# Altium schematic sheet USB.SchDoc
size A4
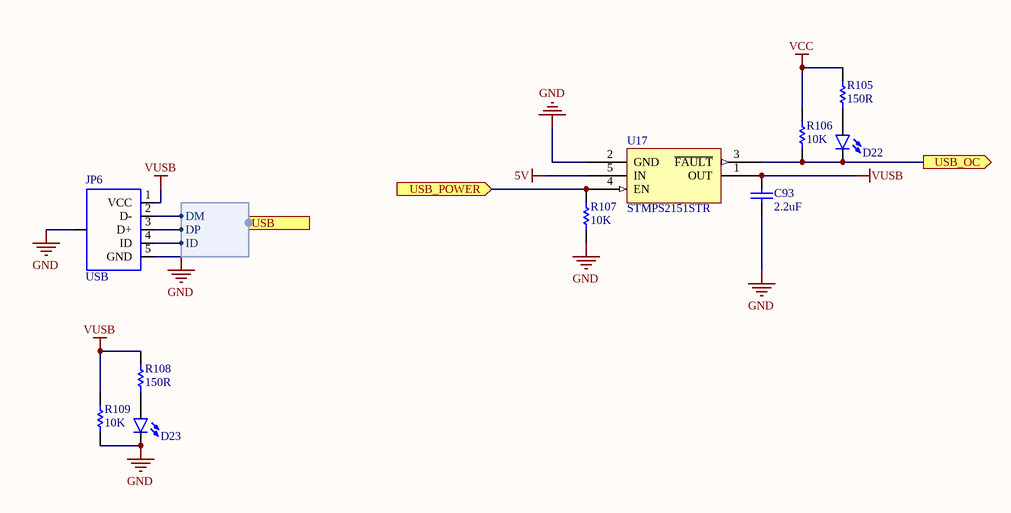
[diagram p0: USB.SchDoc]

## Parts
C93  value 2.2uF  [C1206[3216X160]]  (hidden comment: 2.2uF 16V 1206)
D22  USB_OC  [LED0603]  (value not drawn)
D23  USB_PW  [LED0603]  (value not drawn)
JP6  USB  [USB_MICROB_VERT]
R105  value 150R  [R0603[1608]]  (hidden comment: 150R 1% 0603)
R106  value 10K  [R0603[1608]]  (hidden comment: 10K 1% 0603)
R107  value 10K  [R0603[1608]]  (hidden comment: 10K 1% 0603)
R108  value 150R  [R0603[1608]]  (hidden comment: 150R 1% 0603)
R109  value 10K  [R0603[1608]]  (hidden comment: 10K 1% 0603)
U17  STMPS2151STR  [SOT-23-5L]

## Ports
USB (harness USB), USB_OC (out), USB_POWER (in)

## Harnesses
USB: DM, DP, ID

## Nets
5V: U17.5(IN)
GND: C93.2 D23.C JP6.5(GND) JP6.6(SHIELD) R107.1 R109.1 U17.2(GND)
VCC: R105.2 R106.2
VUSB: C93.1 JP6.1(VCC) R108.2 R109.2 U17.1(OUT)
USB_OC: D22.C R106.1 U17.3(~{FAULT}) ; port USB_OC
USB_POWER: R107.2 U17.4(EN) ; port USB_POWER
NetD22_A: D22.A R105.1
NetD23_A: D23.A R108.1
NetJP6_2: JP6.2(D-) ; port USB.DM
NetJP6_3: JP6.3(D+) ; port USB.DP
NetJP6_4: JP6.4(ID) ; port USB.ID

## Library data of the parts
C93 = CAP_2.2uF_16V_1206_10%: 2.2uF 16V 10% X7R 1206 (3216 Metric); PartNumber: C1206C225K4RACAUTO; Manufacturer: KEMET; Mounting Technology: Surface Mount; PackageReference: 1206; PackageDescription: 1206 (3216 Metric); Voltage: 16V; Tolerance: 10%
D22 D23 = LED_0603_GREEN_5mA: PartNumber: LTST-C193TGKT-5A; Manufacturer: Lite-On Inc.; PackageReference: 0603; PackageDescription: 0603 (1608 Metric); Mounting Technology: Surface Mount
JP6 = USB_MICROB_VERT: PartNumber: 614105150721; Manufacturer: Wurth Electronics; Mounting Technology: Through Hole; PackageReference: USB - Micro B
R105 R108 = RES_150R_0603_1%: 150R 0.25W 1% 0603 (1005 Metric); Manufacturer: Vishay / Dale; PartNumber: CRCW0603150RFKEAHP; Tolerance: 1%; Power: 0.25W; Mounting Technology: Surface Mount; PackageReference: 0603; PackageDescription: 0603 (1608 Metric); ComponentLink1Description: Datasheet; ComponentLink1URL: http://www.vishay.com/docs/20043/crcwhpe3.pdf
R106 R107 R109 = RES_10K_0603_1%: 10K 0.25W 1% 0603 (1005 Metric); Manufacturer: Vishay / Dale; PartNumber: CRCW060310K0FKEAHP; Tolerance: 1%; Power: 0.25W; Mounting Technology: Surface Mount; PackageReference: 0603; PackageDescription: 0603 (1608 Metric); ComponentLink1Description: Datasheet; ComponentLink1URL: http://www.vishay.com/docs/20065/rcse3.pdf
U17 = STMPS2141STR